# EAGLE design boost-board (EAGLE 9.6.2)
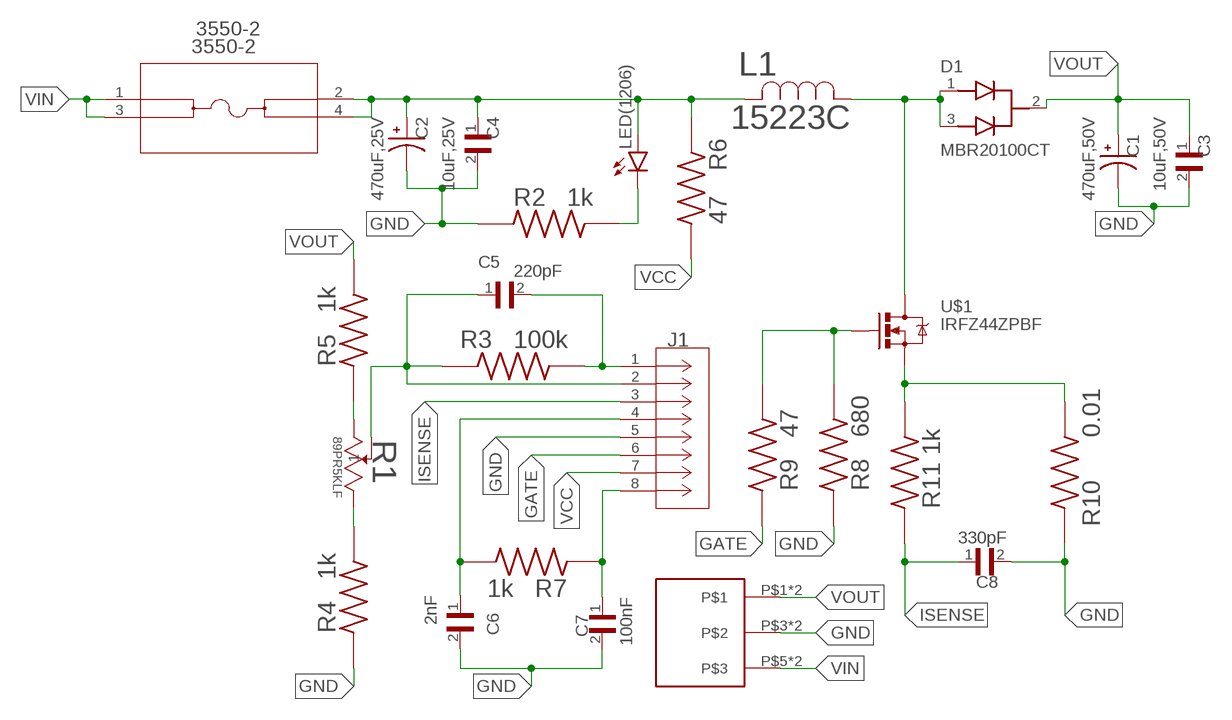
[diagram p0: schematic, sheet 1]

## Parts
3550-2  3550-2  [3550-2_KEY]
C1  470uF,50V  50YXG470MEFC12.5X20  [CAPPRD500W60D1250H2200]
C2  470uF,25V  25YXG470MEFCT810X16  [CAPPRD500W60D1000H1800]
C3  10uF,50V  C1206C104K5RAC7210  [CAPC3216X88N]
C4  10uF,25V  C1206C104K5RAC7210  [CAPC3216X88N]
C5  220pF  C1206C104K5RAC7210  [CAPC3216X88N]
C6  2nF  C1206C104K5RAC7210  [CAPC3216X88N]
C7  100nF  C1206C104K5RAC7210  [CAPC3216X88N]
C8  330pF  C1206C104K5RAC7210  [CAPC3216X88N]
D1  MBR20100CT  [TO254P1066X482X2286-3]
J1  DILB8P-223TLF  [CONN_DILB8P-223TLF_AMP]
L1  15223C  [15223C_MUR]
LED(1206)  LED-FKIT-1206  [FKIT-LED-1206]
R1  89PR5KLF  [RES3_89P_TTE]
R2  1k  RMCF1206JT1K00  [RESC3216X70N]
R3  100k  RMCF1206JT1K00  [RESC3216X70N]
R4  1k  RMCF1206JT1K00  [RESC3216X70N]
R5  1k  RMCF1206JT1K00  [RESC3216X70N]
R6  47  RMCF1206JT1K00  [RESC3216X70N]
R7  1k  RMCF1206JT1K00  [RESC3216X70N]
R8  680  RMCF1206JT1K00  [RESC3216X70N]
R9  47  RMCF1206JT1K00  [RESC3216X70N]
R10  0.01  RMCF1206JT1K00  [RESC3216X70N]
R11  1k  RMCF1206JT1K00  [RESC3216X70N]
U$1  IRFZ44ZPBF  [TO-220]
U$2  FX30B-3S-3.81DSA  [FX30B-4S-3.81DSA]

## Nets
GATE: J1.6 R9.1
GND: C1.N C2.N C3.2 C4.2 C6.2 C7.2 C8.2 J1.5 R2.1 R4.1 R8.1 R10.1 U$2.P$3 U$2.P$4
ISENSE: C8.1 J1.3 R11.1
N$1: C5.1 J1.2 R1.2 R3.1
N$2: C5.2 J1.1 R3.2
N$3: R1.1 R4.2
N$4: R1.3 R5.1
N$5: R8.2 R9.2 U$1.1(G)
N$6: D1.1(ANODE1) D1.3(ANODE2) L1.1 U$1.2(D)
N$7: C7.1 J1.8 R7.1
N$8: LED(1206).C R2.2
N$9: R10.2 R11.2 U$1.3(S)
N$10: 3550-2.2 3550-2.4 C2.P C4.1 L1.2 LED(1206).A R6.2
N$12: C6.1 J1.4 R7.2
VCC: J1.7 R6.1
VIN: 3550-2.1 3550-2.3 U$2.P$5 U$2.P$6
VOUT: C1.P C3.1 D1.2(COMMON_CATHODE) R5.2 U$2.P$1 U$2.P$2

## Library data of the parts
3550-2 = 3550-2:3550-2; BUILT_BY: EMA_Cory; COPYRIGHT: Copyright (C) 2018 Accelerated Designs. All rights reserved; DATASHEET: https://www.digikey.com/htmldatasheets/production/846950/0/0/1/3550-2-drawing.html; MANUFACTURER_PART_NUMBER: 3550-2; SOURCELIBRARY: Keystone_2020-09-02; VENDOR: Keystone Electronics
C1 = 50YXG470MEFC12.5X20:50YXG470MEFC12.5X20; MF: Rubycon; MP: 50YXG470MEFC12.5X20; PACKAGE: None
C2 = 25YXG470MEFCT810X16:25YXG470MEFCT810X16; MF: Rubycon; MP: 25YXG470MEFCT810X16; PACKAGE: None
C3-C8 = C1206C104K5RAC7210:C1206C104K5RAC7210: Cap Ceramic 0.1uF 50V X7R 10% Pad SMD 1206 125°C T/R; DESCRIPTION: 0.1µF ±10% 50V Ceramic Capacitor X7R 1206 (3216 Metric); DIGI-KEY_PART_NUMBER: 399-7357-2-ND; MF: KEMET; MP: C1206C104K5RAC7210; PACKAGE: 3216 KEMET; PURCHASE-URL: https://pricing.snapeda.com/search/part/C1206C104K5RAC7210/?ref=eda
D1 = MBR20100CT:MBR20100CT: MBR20100 Series 100 V 20 A Flange Mount Schottky Barrier Rectifier - TO-220AB Check prices <https://pricing.snapeda.com/parts/MBR20100CT/Motorola/view-part?ref=eda>; AVAILABILITY: Not in stock; DESCRIPTION: Diode Array 1 Pair Common Cathode Schottky 100V Through Hole TO-220-3; MF: Motorola; MP: MBR20100CT; PACKAGE: TO-220-3 ON Semiconductor; PRICE: None
J1 = DILB8P-223TLF:DILB8P-223TLF; BUILT_BY: EMA_Cory; COPYRIGHT: Copyright (C) 2018 Accelerated Designs. All rights reserved; DATASHEET: https://www.amphenol-icc.com/media/wysiwyg/files/drawing/10052485.pdf; MANUFACTURER_PART_NUMBER: DILB8P-223TLF; SOURCELIBRARY: Amphenol_ICC_2020-04-09; VENDOR: Amphenol
L1 = 15223C_INID:15223C; BUILT_BY: EMA_UL_Team; MANUFACTURER_PART_NUMBER: 15223C; SOURCELIBRARY: Murata_2012-11-05_1500; VENDOR: Murata
LED(1206) = SparkFun-LED:LED: LED (Generic) Standard schematic elements and footprints for 5mm, 3mm, 1206, and 0603 sized LEDs. Generic LEDs with no color specified.
R1 = trimmer_res:89PR5KLF; COPYRIGHT: Copyright (C) 2016 Accelerated Designs. All rights reserved; MANUFACTURER_PART_NUMBER: 89PR5KLF; SOURCELIBRARY: TTELECTRONICS_2018-04-11; VENDOR: TT Electronics
R2-R11 = RMCF1206JT1K00:RMCF1206JT1K00; DESCRIPTION: 1 kOhms ±5% 0.25W, 1/4W Chip Resistor 1206 (3216 Metric) Automotive AEC-Q200 Thick Film; DIGI-KEY_PART_NUMBER: RMCF1206JT1K00CT-ND; MF: Stackpole Electronics Inc; MP: RMCF1206JT1K00; PACKAGE: 3216 Stackpole
U$1 = IRFZ44ZPBF:IRFZ44ZPBF; DESCRIPTION: N-Channel 55V 51A (Tc) 80W (Tc) Through Hole TO-220AB; DIGI-KEY_PART_NUMBER: IRFZ44ZPBF-ND; MF: Infineon Technologies; MP: IRFZ44ZPBF; PACKAGE: TO-220 Infineon
U$2 = FX30B-4S-3.81DSA:FX30B-3S-3.81DSA

## Board
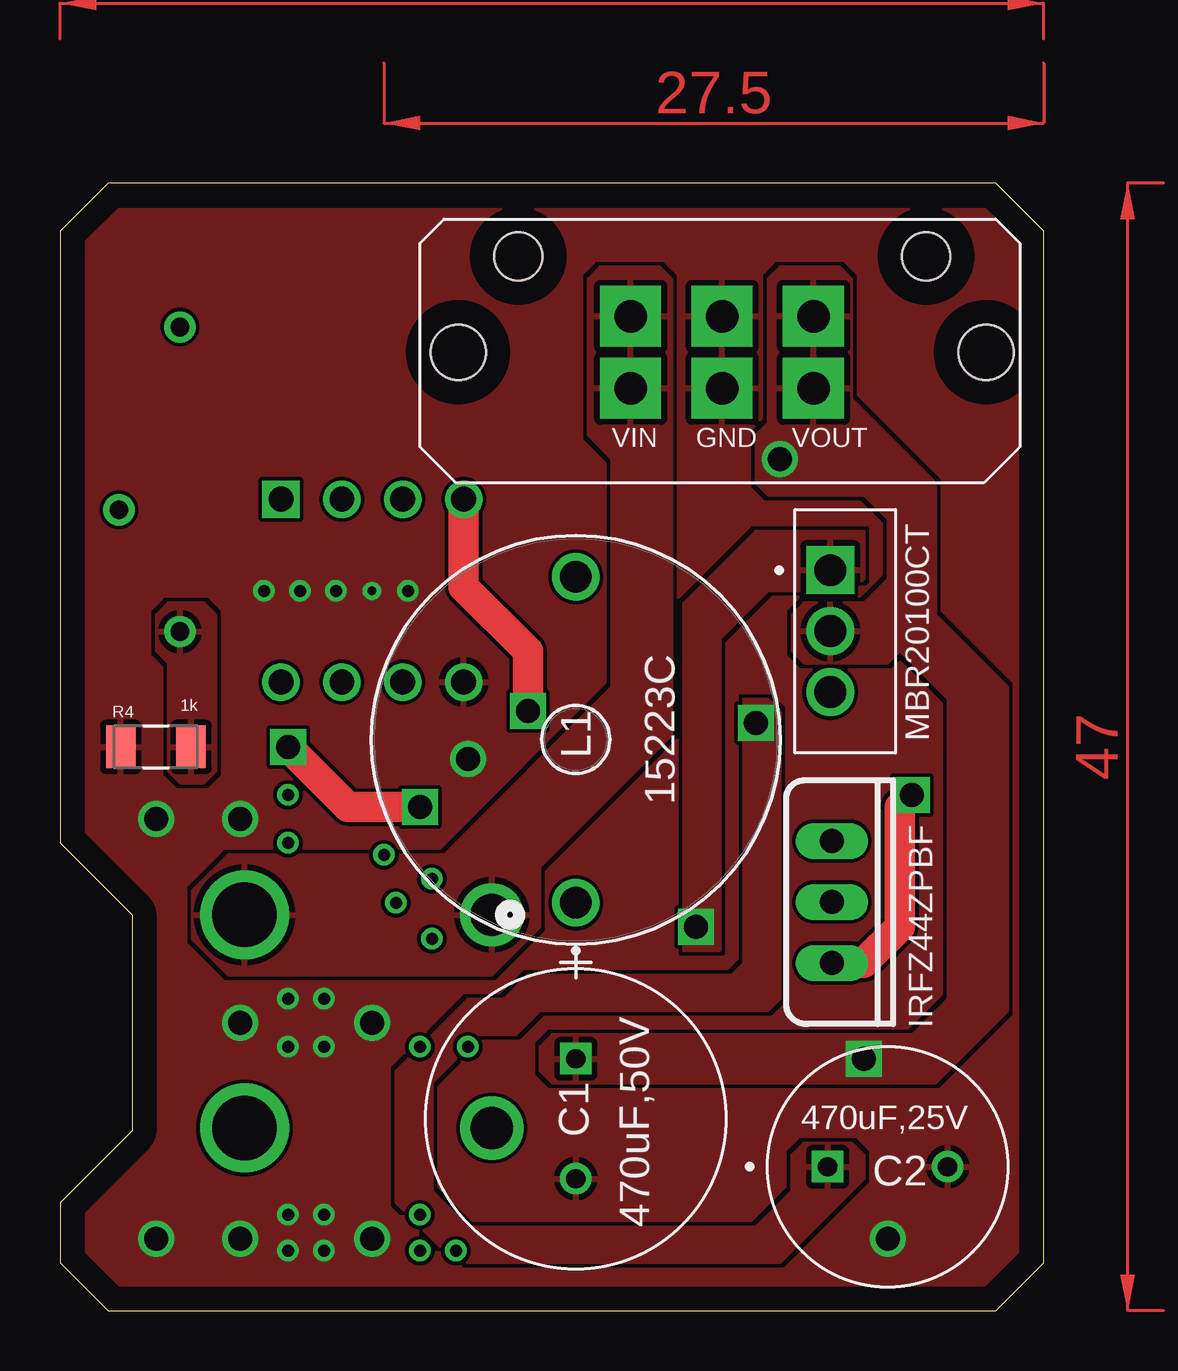
[diagram p1: board, top side]
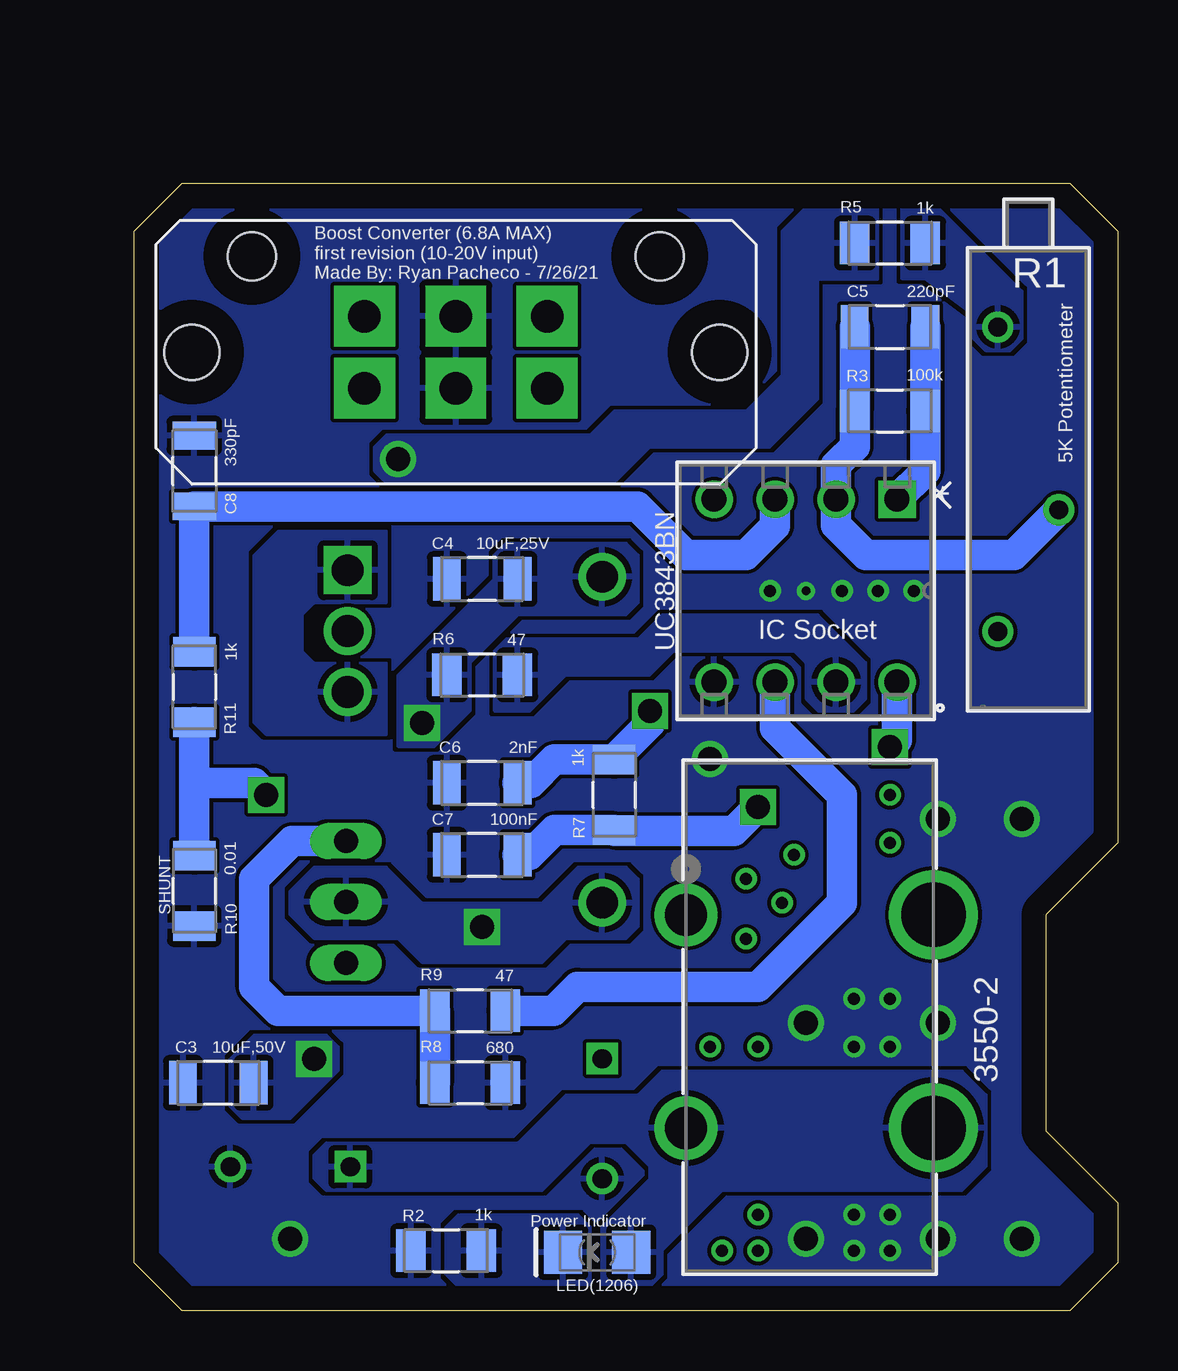
[diagram p2: board, bottom side, seen from below]

Size 41 x 47 mm. Coordinates in mm from the lower left corner, seen from the top.
Outline: 39,47 2,47 0,45 0,19.5 3,16.5 3,7.5 0,4.5 0,2 2,0 39,0 41,2 41,45 39,47
Copper layers (1*16): Top 0.035mm / dielectric 1.5mm / Bottom 0.035mm
Design rules "default": minimum track width 6mil, minimum drill 0.35mm, track to track 6mil, track to pad 6mil, pad to pad 6mil, via to via 6mil, smd to smd 6mil, copper to edge 40mil, drill to drill 6mil, minimum pad ring 10mil, minimum via ring 8mil, stop-mask expansion 4mil, vias tented up to drill 0mil, thermal gap 10mil

### Footprints (pad centres in the part's own frame; a part is rotated, then mirrored left to right if it is on the bottom)
3550-2_KEY = drill 1.753 pad 2.261: 1 0,0; 2 0,-8.89 | drill 2.692 pad 3.2: 3 10.312,0; 4 10.312,-8.89
CAPPRD500W60D1250H2200 = drill 0.8 pad 1.15: N 2.5,0 | drill 0.8 pad 1.15 square: P -2.5,0
CAPPRD500W60D1000H1800 = drill 0.8 pad 1.15: N 2.5,0 | drill 0.8 pad 1.15 square: P -2.5,0
CAPC3216X88N = smd 1.16 x 1.82: 1 -1.475,0; 2 1.475,0
TO254P1066X482X2286-3 = drill 1.33 pad 2 square: 1 0,0 | drill 1.33 pad 2: 2 2.54,0; 3 5.08,0
CONN_DILB8P-223TLF_AMP = drill 1.041 pad 1.549 square: 1 0,0 | drill 1.041 pad 1.549: 2 0,-2.54; 3 0,-5.08; 4 0,-7.62; 5 7.62,-7.62; 6 7.62,-5.08; 7 7.62,-2.54; 8 7.62,0
15223C_MUR = drill 1.321 pad 1.829: 1 0,0; 2 13.589,0
FKIT-LED-1206 = smd 1.6 x 1.803: A -1.422,0; C 1.422,0
RES3_89P_TTE = drill 0.787 pad 1.295: 1 12.7,0; 2 7.62,2.54; 3 0,0
RESC3216X70N = smd 1.23 x 1.77: 1 -1.466,0; 2 1.466,0
TO-220 = drill 1 long: 1 -2.54,0; 2 0,0; 3 2.54,0
FX30B-4S-3.81DSA = drill 1.35 pad 2.54 square: P$1 -3.81,-1.505; P$2 -3.81,1.495; P$3 0,-1.505; P$4 0,1.495; P$5 3.81,-1.505; P$6 3.81,1.495 | hole 2.3: 11,0; -11,0 | hole 2: 8.5,4; -8.5,4

### Placement (x,y rotation side)
3550-2  18,16.5 0 bottom
C1  21.5,8 270 top
C2  34.5,6 0 top
C3  37.5,9.5 180 bottom
C4  26.5,30.5 180 bottom
C5  9.5,41 0 bottom
C6  26.5,22 180 bottom
C7  26.5,19 180 bottom
C8  38.5,35 90 bottom
D1  32.11,30.86 270 top
J1  9.21,33.82 270 bottom
L1  21.5,17 90 top
LED(1206)  21.71,2.43 180 bottom
R1  5,41 270 bottom
R2  28,2.5 0 bottom
R3  9.5,37.5 0 bottom
R4  4,23.5 0 top
R5  9.5,44.5 180 bottom
R6  26.5,26.5 180 bottom
R7  21,21.5 90 bottom
R8  27,9.5 180 bottom
R9  27,12.5 180 bottom
R10  38.5,17.5 90 bottom
R11  38.5,26 270 bottom
U$1  32.18,17.03 270 top
U$2  27.6,39.95 0 bottom

### Tracks (layer width: path | path; a pad name or v marks a point on that pad's centre or on a via)
GATE
  Bottom 1.27: J1.6 14.29,24.29 11.5,21.5 11.5,17 15,13.5 22.53,13.5 23.53,12.5 R9.1
GND  (via drill 0.35, 0.5, 1)
  other vias: 4,3 13,3 9.5,2.5 11,2.5 11,4 9.5,4 7.5,3 7.5,12 9.5,13 11,13 9.5,11 11,11 13,12 7.5,20.5 4,20.5 8.5,30 11.5,30 10,30 14.5,30 17,23 34.5,3 13,30
  pour Top (rank 3): 40.5,45 40.5,2 39,0.5 2.5,0.5 0.5,2.5 0.5,44.5 2.5,46.5 39,46.5
  pour Bottom (rank 3): 2.5,46.5 39,46.5 40.5,45 40.5,2 39,0.5 2.5,0.5 0.5,2.5 0.5,44.5
GND1  (via drill 0.5)
  other vias: 15,4
GND2  (via drill 0.5)
  other vias: 15,2.5
GND3  (via drill 0.5)
  other vias: 16.5,2.5
GND4  (via drill 0.5)
  other vias: 15,11
GND5  (via drill 0.5)
  other vias: 17,11
GND6  (via drill 0.5)
  other vias: 9.5,21.5
GND7  (via drill 0.5)
  other vias: 9.5,19.5
GND8  (via drill 0.5)
  other vias: 13.5,19
GND9  (via drill 0.5)
  other vias: 15.5,18
GND10  (via drill 0.5)
  other vias: 14,17
GND11  (via drill 0.5)
  other vias: 15.5,15.5
ISENSE
  Bottom 1.27: J1.3 14.29,32.71 15.5,31.5 18,31.5 20.02,33.52 C8.1 R11.1
N$1
  Bottom 1.27: R3.1 | C5.1 R3.1 | R1.2 4.34,31.5 10.5,31.5 11.75,32.75 J1.2 11.75,35.25 10.97,36.02 R3.1
N$2
  Bottom 1.27: C5.2 R3.2 8.03,35 J1.1
N$3
  pour Top: 6,29.5 4.5,29.5 4,29 4,27.5 4.5,27 4.5,22.5 5,22 6,22 6.5,22.5 6.5,29
N$4
  pour Bottom: 9,46 7.5,46 4,42.5 4,40.5 4.5,40 5.5,40 6,40.5 6,41.5 8,43 9,43
N$5
  Bottom 1.27: R8.2 R9.2 35,12.5 36,13.5 36,18 34.43,19.57 U$1.1
N$6  (via drill 1)
  other vias: 26.5,16
  pour Bottom: 22.5,18.5 20.5,18.5 20,18 20,16 20.5,15.5 23,15.5 24,14.5 29,14.5 30,15.5 33.5,15.5 34.5,16.5 34.5,17.5 33.5,18.5 30.5,18.5 29,17 24,17
  pour Top: 29,32.5 33.5,32.5 33.5,30.5 33,30 29.5,30 27.5,28 27.5,15 26,15 26,29.5
  pour Bottom: 35,32.5 30.5,32.5 30.5,29.5 33.5,29.5 34,29 34,27.5 33.5,27 30.5,27 30.5,24 35.5,24 36,24.5 36,31.5
N$7  (via drill 1)
  Top 1.27: v9.5,23.5 12,21 v15,21
  Bottom 1.27: C7.1 24.52,19 23.49,20.03 R7.1 20.97,20 16,20 v15,21 | J1.8 9.21,23.79 v9.5,23.5
N$8
  pour Bottom: 27.5,4 22.5,4 22,3.5 22,1 27.5,1 28,1.5 28,3.5
N$9  (via drill 1)
  Top 1.27: U$1.3 33.49,14.49 35,16 35,21 v35.5,21.5
  Bottom 1.27: R11.2 38.5,22 | 38.5,22 R10.2 | 38.5,22 36,22 v35.5,21.5
N$10  (via drill 1)
  other vias: 29,24.5
  pour Bottom: 19,10 6.5,10 5.5,9 5.5,6 6.5,5 16.5,5 19,2.5 19,1.5 19.5,1 21.5,1 21.5,3.5 19.5,5.5 19.5,6 20.5,7 22,7 24,5 33,5 33.5,5.5 33.5,6.5 33,7 25,7 23,9 20,9
  pour Bottom: 25.5,32 20.5,32 20,31.5 20,29.5 20.5,29 25,29 27,27 27,25 28.5,23.5 30,23.5 30,26.5 26,30.5 26,31.5
  pour Top: 33,7 33.5,6.5 33.5,5.5 30,2 16.5,2 14,4.5 14,10 17,13 18.5,13 19.5,14 28,14 28.5,14.5 28.5,25.5 29.5,25.5 30,25 30,13 29.5,12.5 20,12.5 19,11.5 17.5,11.5 15.5,9.5 15.5,5 17,3.5 29,3.5 30.5,5 30.5,6.5 31,7
N$12  (via drill 1)
  Top 1.27: J1.4 16.83,30.17 19.5,27.5 v19.5,25
  Bottom 1.27: v19.5,25 19.5,24.47 R7.2 23.5,22.97 24.47,22 C6.1
VCC
  pour Bottom: 13,27 13,25.5 12.5,25 11,25 10.5,25.5 10.5,27 12.5,29 19,29 20,28 25.5,28 26,27.5 26,25 24.5,25 23,26.5 19.5,26.5 18.5,27.5 13.5,27.5
VIN
  pour Top: 25.5,24 25.5,43 25,43.5 22.5,43.5 22,43 22,36.5 23,35.5 23,26 16,19 7,19 5.5,17.5 5.5,15.5 7,14 18,14 20,16 20,18.5
VOUT  (via drill 1)
  other vias: 30,35.5 33.5,10.5
  pour Bottom: 10,46 13,46 14,45 14,39 15.5,37.5 21,37.5 22,36.5 30.5,36.5 31,36 31,35 30.5,34.5 21,34.5 19.5,36 14.5,36 12.5,38 12.5,43 10,43
  pour Top: 32.5,43.5 30,43.5 29.5,43 29.5,37 29,36.5 29,34.5 29.5,34 33.5,34 34.5,33 34.5,30.5 33.5,29.5 31,29.5 30.5,29 30.5,27.5 31,27 34.5,27 36.5,29 36.5,34.5 33,38 33,43
  pour Top: 34.5,30 34,29.5 34,28.5 37,25.5 37,13 35.5,11.5 20.5,11.5 20,11 20,10 20.5,9.5 36.5,9.5 39.5,12.5 39.5,26 35.5,30
  pour Bottom: 36,11.5 33,11.5 32.5,11 32.5,10 34.5,8 36.5,8 37,8.5 37,10.5
(copper drawn outside any net)
  shapes: Top area x3

### Text on the board
tNames: VIN | GND | VOUT | 1k
bNames: Boost Converter (6.8A MAX) / first revision (10-20V input) / Made By: Ryan Pacheco - 7/26/21 | 5K Potentiometer | IC Socket | UC3843BN | SHUNT | Power Indicator